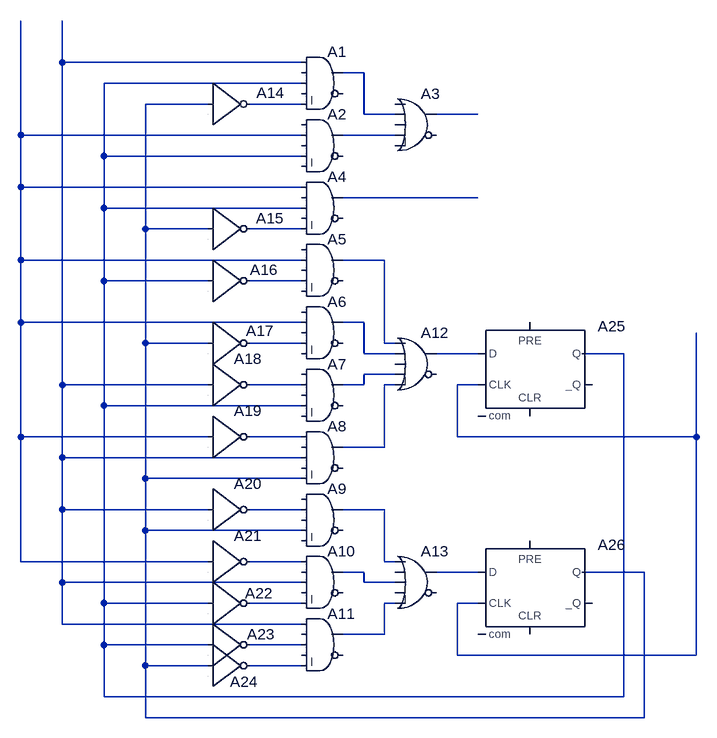
[diagram p0: schematic statemachine.asc]
statemachine.asc, the LTspice schematic file:
Version 4
SHEET 1 1912 952
WIRE 928 -880 928 -944
WIRE 1296 -880 928 -880
WIRE 1392 -864 1360 -864
WIRE 1296 -848 992 -848
WIRE 1152 -816 1056 -816
WIRE 1296 -816 1216 -816
WIRE 1392 -800 1392 -864
WIRE 1440 -800 1392 -800
WIRE 1568 -800 1504 -800
WIRE 864 -768 864 -944
WIRE 1296 -768 864 -768
WIRE 1440 -768 1360 -768
WIRE 992 -736 992 -848
WIRE 1296 -736 992 -736
WIRE 864 -688 864 -768
WIRE 1296 -688 864 -688
WIRE 1568 -672 1360 -672
WIRE 992 -656 992 -736
WIRE 1296 -656 992 -656
WIRE 1056 -624 1056 -816
WIRE 1152 -624 1056 -624
WIRE 1296 -624 1216 -624
WIRE 864 -576 864 -688
WIRE 1296 -576 864 -576
WIRE 1424 -576 1360 -576
WIRE 992 -544 992 -656
WIRE 1152 -544 992 -544
WIRE 1296 -544 1216 -544
WIRE 864 -480 864 -576
WIRE 1296 -480 864 -480
WIRE 1392 -480 1360 -480
WIRE 1056 -448 1056 -624
WIRE 1152 -448 1056 -448
WIRE 1296 -448 1216 -448
WIRE 1424 -448 1424 -576
WIRE 1440 -448 1424 -448
WIRE 1392 -432 1392 -480
WIRE 1440 -432 1392 -432
WIRE 1568 -432 1504 -432
WIRE 1792 -432 1728 -432
WIRE 1440 -400 1392 -400
WIRE 928 -384 928 -880
WIRE 1152 -384 928 -384
WIRE 1296 -384 1216 -384
WIRE 1392 -384 1392 -400
WIRE 1392 -384 1360 -384
WIRE 1440 -384 1424 -384
WIRE 1568 -384 1536 -384
WIRE 992 -352 992 -544
WIRE 1296 -352 992 -352
WIRE 864 -304 864 -480
WIRE 1152 -304 864 -304
WIRE 1296 -304 1216 -304
WIRE 1536 -304 1536 -384
WIRE 1904 -304 1904 -464
WIRE 1904 -304 1536 -304
WIRE 1424 -288 1424 -384
WIRE 1424 -288 1360 -288
WIRE 928 -272 928 -384
WIRE 1296 -272 928 -272
WIRE 1056 -240 1056 -448
WIRE 1296 -240 1056 -240
WIRE 928 -192 928 -272
WIRE 1152 -192 928 -192
WIRE 1296 -192 1216 -192
WIRE 1424 -192 1360 -192
WIRE 1056 -160 1056 -240
WIRE 1296 -160 1056 -160
WIRE 864 -112 864 -304
WIRE 1152 -112 864 -112
WIRE 1296 -112 1216 -112
WIRE 1424 -112 1424 -192
WIRE 1440 -112 1424 -112
WIRE 1392 -96 1360 -96
WIRE 1568 -96 1504 -96
WIRE 1824 -96 1728 -96
WIRE 928 -80 928 -192
WIRE 1296 -80 928 -80
WIRE 1392 -80 1392 -96
WIRE 1440 -80 1392 -80
WIRE 992 -48 992 -352
WIRE 1152 -48 992 -48
WIRE 1296 -48 1216 -48
WIRE 1440 -48 1424 -48
WIRE 1568 -48 1536 -48
WIRE 928 -16 928 -80
WIRE 1296 -16 928 -16
WIRE 1424 0 1424 -48
WIRE 1424 0 1360 0
WIRE 992 16 992 -48
WIRE 1152 16 992 16
WIRE 1296 16 1216 16
WIRE 1536 32 1536 -48
WIRE 1904 32 1904 -304
WIRE 1904 32 1536 32
WIRE 1056 48 1056 -160
WIRE 1152 48 1056 48
WIRE 1296 48 1216 48
WIRE 992 96 992 16
WIRE 1792 96 1792 -432
WIRE 1792 96 992 96
WIRE 1056 128 1056 48
WIRE 1824 128 1824 -96
WIRE 1824 128 1056 128
SYMBOL Digital\\and 1328 -912 R0
SYMATTR InstName A1
SYMBOL Digital\\and 1328 -816 R0
SYMATTR InstName A2
SYMBOL Digital\\or 1472 -848 R0
SYMATTR InstName A3
SYMBOL Digital\\and 1328 -720 R0
SYMATTR InstName A4
SYMBOL Digital\\and 1328 -624 R0
SYMATTR InstName A5
SYMBOL Digital\\and 1328 -528 R0
SYMATTR InstName A6
SYMBOL Digital\\and 1328 -432 R0
SYMATTR InstName A7
SYMBOL Digital\\and 1328 -336 R0
SYMATTR InstName A8
SYMBOL Digital\\and 1328 -240 R0
SYMATTR InstName A9
SYMBOL Digital\\and 1328 -144 R0
SYMATTR InstName A10
SYMBOL Digital\\and 1328 -48 R0
SYMATTR InstName A11
SYMBOL Digital\\or 1472 -480 R0
SYMATTR InstName A12
SYMBOL Digital\\or 1472 -144 R0
SYMATTR InstName A13
SYMBOL Digital\\inv 1152 -880 R0
WINDOW 0 75 47 Left 2
SYMATTR InstName A14
SYMBOL Digital\\inv 1152 -688 R0
WINDOW 0 74 48 Left 2
SYMATTR InstName A15
SYMBOL Digital\\inv 1152 -608 R0
WINDOW 0 65 47 Left 2
SYMATTR InstName A16
SYMBOL Digital\\inv 1152 -512 R0
WINDOW 0 59 45 Left 2
SYMATTR InstName A17
SYMBOL Digital\\inv 1152 -448 R0
SYMATTR InstName A18
SYMBOL Digital\\inv 1152 -368 R0
SYMATTR InstName A19
SYMBOL Digital\\inv 1152 -256 R0
SYMATTR InstName A20
SYMBOL Digital\\inv 1152 -176 R0
SYMATTR InstName A21
SYMBOL Digital\\inv 1152 -112 R0
WINDOW 0 57 49 Left 2
SYMATTR InstName A22
SYMBOL Digital\\inv 1152 -48 R0
WINDOW 0 60 48 Left 2
SYMATTR InstName A23
SYMBOL Digital\\inv 1152 -16 R0
WINDOW 0 34 89 Left 2
SYMATTR InstName A24
SYMBOL Digital\\dflop 1648 -480 R0
SYMATTR InstName A25
SYMBOL Digital\\dflop 1648 -144 R0
SYMATTR InstName A26

The netlist it stands for:
* statemachine.asc
A1 N001 0 N003 0 N005 0 N002 0 AND
A2 0 N007 0 N003 0 0 N008 0 AND
A3 0 N002 0 N008 0 0 N006 0 OR
A4 N007 0 N003 0 N010 0 N009 0 AND
A5 0 N007 0 N012 0 0 N011 0 AND
A6 0 N007 0 N014 0 0 N013 0 AND
A7 0 N017 0 N003 0 0 N016 0 AND
A8 N020 0 N001 0 N004 0 N018 0 AND
A9 0 N021 0 N004 0 0 N022 0 AND
A10 N023 0 N001 0 N026 0 N024 0 AND
A11 N001 0 N028 0 N029 0 N027 0 AND
A12 N011 N013 0 N016 N018 0 N015 0 OR
A13 N022 0 N024 0 N027 0 N025 0 OR
A14 N004 0 0 0 0 N005 0 0 BUF
A15 N004 0 0 0 0 N010 0 0 BUF
A16 N003 0 0 0 0 N012 0 0 BUF
A17 N004 0 0 0 0 N014 0 0 BUF
A18 N001 0 0 0 0 N017 0 0 BUF
A19 N007 0 0 0 0 N020 0 0 BUF
A20 N001 0 0 0 0 N021 0 0 BUF
A21 N007 0 0 0 0 N023 0 0 BUF
A22 N003 0 0 0 0 N026 0 0 BUF
A23 N003 0 0 0 0 N028 0 0 BUF
A24 N004 0 0 0 0 N029 0 0 BUF
A25 N015 0 N019 0 0 0 N003 0 DFLOP
A26 N025 0 N019 0 0 0 N004 0 DFLOP
.backanno
.end